# Altium schematic sheet [4]-INTERFACE_BOARD.SchDoc
size A4
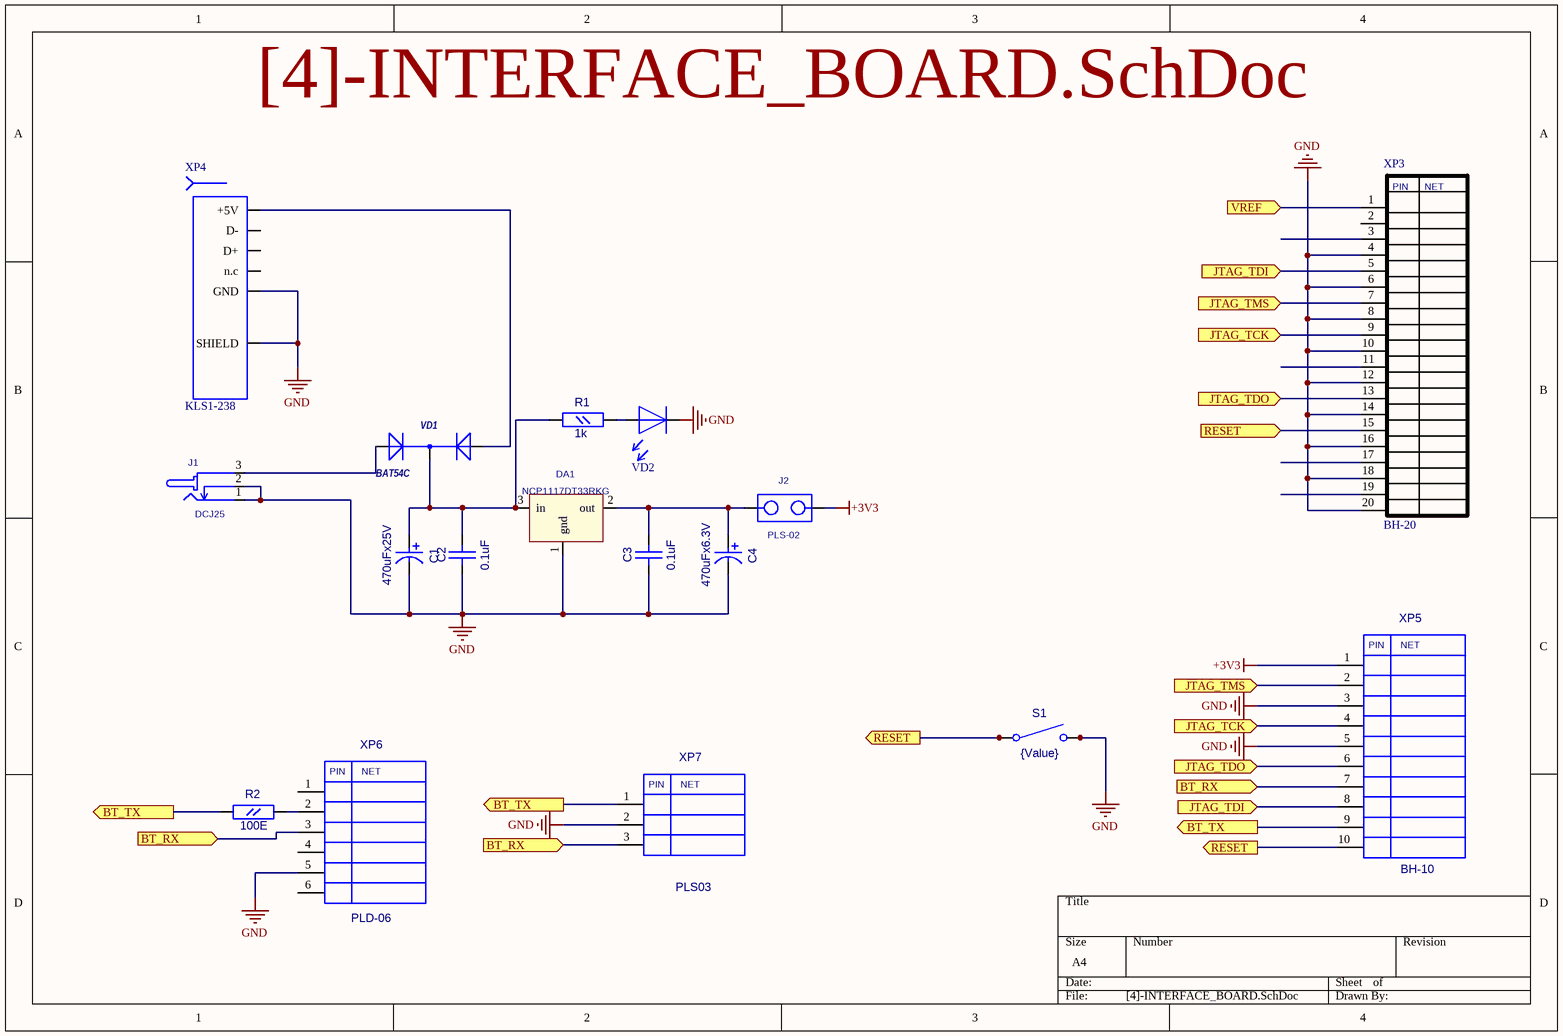
[diagram p0: [4]-INTERFACE_BOARD.SchDoc]

## Parts
C1  value 470uFx25V  [CC8X3.5]  (hidden comment: CAP0.35)
C2  0.1uF  [CC0603]
C3  0.1uF  [CC0603]
C4  value 470uFx6.3V  [CC8X3.5]  (hidden comment: CAP0.35)
DA1  NCP1117DT33RKG  [D-PAK(TO-252AA)]
J1  DCJ25  [DCJ25]
J2  PLS-02  [PLS-02]
R1  1k  [RC0603]
R2  100E  [RC0603]
S1  value {Value}  [7906H-1]  (hidden comment: SWT-2/5)
VD1  BAT54C  [SOT-23(123)]
VD2  LED_0805  [LED0805]  (value not drawn)
XP3  BH-20  [BH-20]
XP4  KLS1-238  [KLS1-238]
XP5  BH-10  [BH-10]
XP6  PLD-06  [PIN6]
XP7  PLS03  [PLS-03]

## Ports
BT_RX (in), BT_TX (out), JTAG_TCK (in), JTAG_TDI (in), JTAG_TDO (in), JTAG_TMS (in), RESET (in), RESET (out), VREF (in)

## Nets
+3V3: J2.2 XP5.1
GND: C1.2 C2.1(A) C3.1(A) C4.2 DA1.1(gnd) J1.1 J1.2 S1.3(C2) S1.4 VD2.2 XP3.4 XP3.6 XP3.8 XP3.10 XP3.12 XP3.14 XP3.16 XP3.18 XP3.20 XP4.5(GND) XP4.6(SHIELD) XP5.3 XP5.5 XP6.5 XP7.2
BT_RX: XP5.7 XP6.3 XP7.3 ; port BT_RX
BT_TX: R2.1(A) XP5.9 XP7.1 ; port BT_TX
JTAG_TCK: XP3.9 XP5.4 ; port JTAG_TCK
JTAG_TDI: XP3.5 XP5.8 ; port JTAG_TDI
JTAG_TDO: XP3.13 XP5.6 ; port JTAG_TDO
JTAG_TMS: XP3.7 XP5.2 ; port JTAG_TMS
RESET: S1.1(C1) S1.2 XP3.15 XP5.10 ; port RESET
VREF: XP3.1 ; port VREF
NetC1_1: C1.1 C2.2(B) DA1.3(in) R1.2(B) VD1.3(K)
NetC3_2: C3.2(B) C4.1 DA1.2(out) J2.1
NetJ1_3: J1.3 VD1.1(A)
NetR1_1: R1.1(A) VD2.1
NetR2_2: R2.2(B) XP6.2
NetVD1_2: VD1.2(A) XP4.1(+5V)

Not connected (* = marked no-connect by the designer): XP3 2 3 11 17(16) 19(16); XP4 2(D-) 3(D+) 4(n.c); XP6 1 4 6

## Notes on the sheet
- (in symbol BH-10) PIN; NET
- (in symbol BH-20) PIN; NET
- (in symbol PLD-06) PIN; NET
- (in symbol PLS03) PIN; NET

## Library data of the parts
C2 C3 = CC0603: Value: 0.1uF
DA1 = NCP1117DT33RKG: Linear Regulator 3.3V; Value: *
R1 R2 = RC0603
  R1: Value: 1k
  R2: Value: 100E
S1 = SWT-2/5: Switch, Single Pole, Single Throw, Normally Open
XP4 = MicroUSB KLS1-238: Value: KLS1-238
XP6 = PLD-06: PLD06; Value: *
J1 = DCJ25: Value: *
J2 = PLS-02: Value: *
VD1 = BAT54C: Value: *
VD2 = LED_0805: Value: LED_0805
XP3 = BH-20: Value: BH-20
XP5 = BH-10: Value: *
XP7 = PLS03: Value: *